# Altium schematic sheet handm_altimeter.SchDoc
size A4
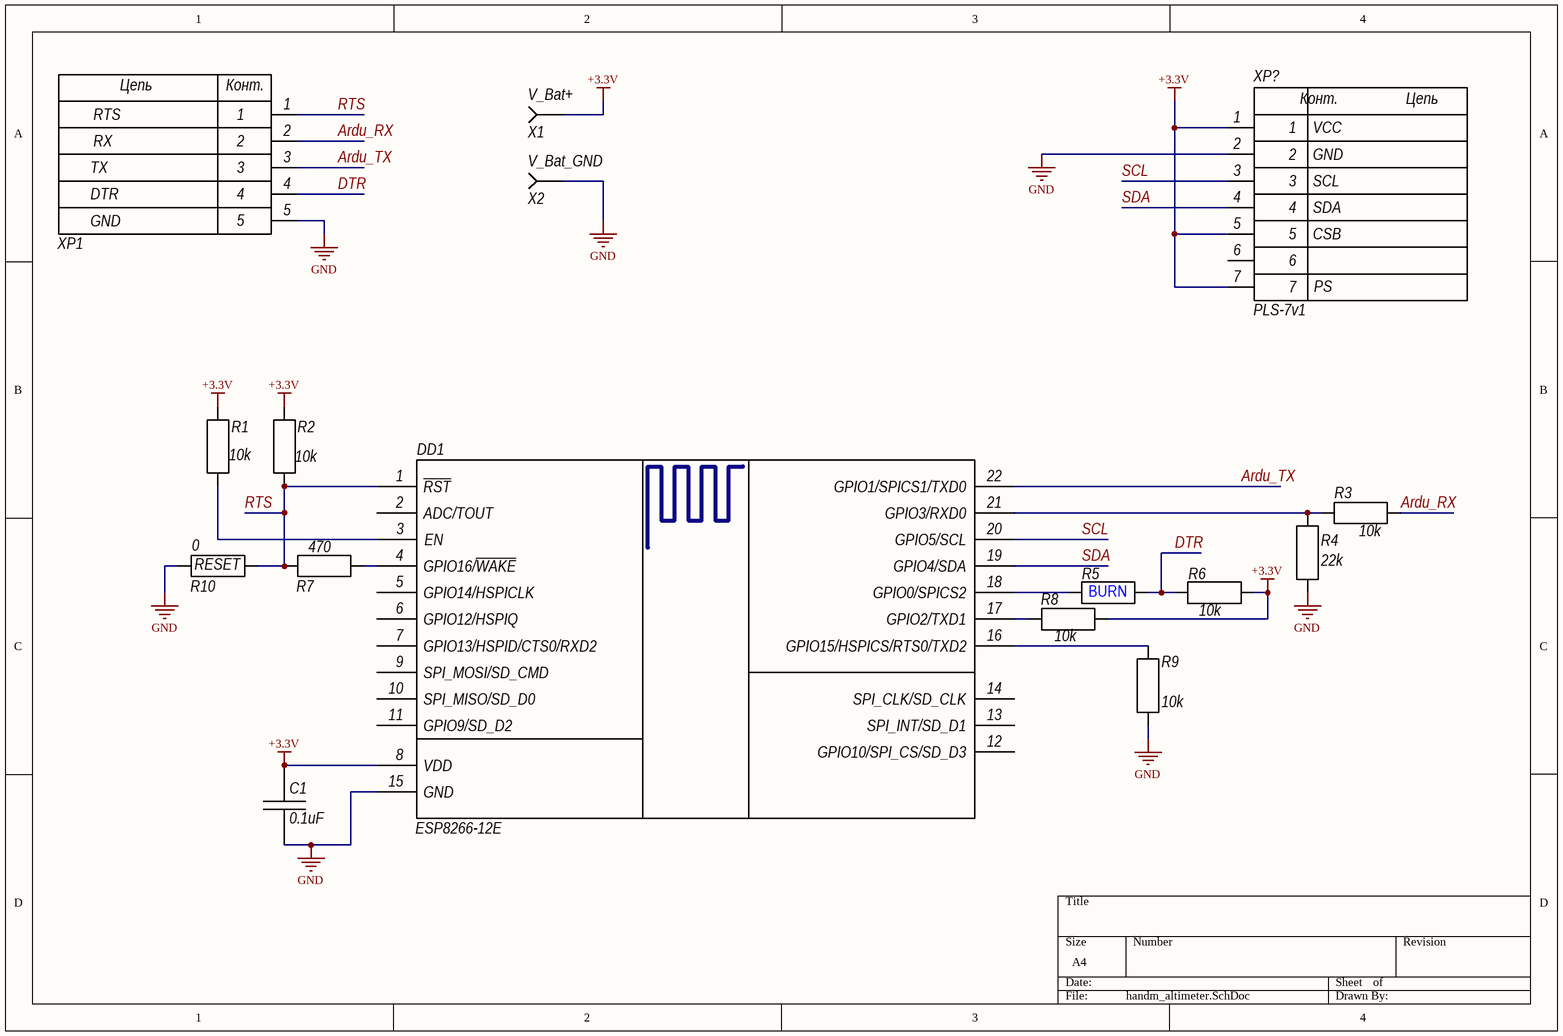
[diagram p0: handm_altimeter.SchDoc]

## Parts
C1  value 0.1uF  [CAP EIA 0603]  (hidden comment: Cap EIA 0603)
DD1  ESP8266-12E  [ESP8266 ESP-12-E]
R1  value 10k  [RES EIA 0603]  (hidden comment: Res EIA 0603)
R2  value 10k  [RES EIA 0603]  (hidden comment: Res EIA 0603)
R3  value 10k  [RES EIA 0603]  (hidden comment: Res EIA 0603)
R4  value 22k  [RES EIA 0603]  (hidden comment: Res EIA 0603)
R5  BURN  [RES EIA 0603]
R6  value 10k  [RES EIA 0603]  (hidden comment: Res EIA 0603)
R7  value 470  [RES EIA 0603]  (hidden comment: Res EIA 0603)
R8  value 10k  [RES EIA 0603]  (hidden comment: Res EIA 0603)
R9  value 10k  [RES EIA 0603]  (hidden comment: Res EIA 0603)
R10  value 0  [RES EIA 0603]  (hidden comment: Res EIA 0603)
X1  V_Bat+  [Pin - Referal]  (no BOM)
X2  V_Bat_GND  [Pin - Referal]  (no BOM)
XP1  BM05B-SRSS-TB  [BM05B-SRSS-TB]  (value not drawn)
XP?  PLS-7v1  [PLS-7v1]

## Nets
+3.3V: C1.2 DD1.8(VDD) R1.2 R2.2 R6.2 R8.2 X1.1 XP?.1 XP?.5 XP?.7
GND: C1.1 DD1.15(GND) R4.1 R9.1 R10.1 X2.1 XP1.5 XP?.2
Ardu_RX: R3.2 XP1.2
Ardu_TX: DD1.22(GPIO1/SPICS1/TXD0) XP1.3
DTR: R5.2 R6.1 XP1.4
RTS: DD1.1(~{RST}) R2.1 R7.1 R10.2 XP1.1
SCL: DD1.20(GPIO5/SCL) XP?.3
SDA: DD1.19(GPIO4/SDA) XP?.4
NetDD1_3: DD1.3(EN) R1.1
NetDD1_4: DD1.4(GPIO16/~{WAKE}) R7.2
NetDD1_16: DD1.16(GPIO15/HSPICS/RTS0/TXD2) R9.2
NetDD1_17: DD1.17(GPIO2/TXD1) R8.1
NetDD1_18: DD1.18(GPIO0/SPICS2) R5.1
NetDD1_21: DD1.21(GPIO3/RXD0) R3.1 R4.2

Not connected (* = marked no-connect by the designer): DD1 2(ADC/TOUT) 5(GPIO14/HSPICLK) 6(GPIO12/HSPIQ) 7(GPIO13/HSPID/CTS0/RXD2) 9(SPI_MOSI/SD_CMD) 10(SPI_MISO/SD_D0) 11(GPIO9/SD_D2) 12(GPIO10/SPI_CS/SD_D3) 13(SPI_INT/SD_D1) 14(SPI_CLK/SD_CLK); XP? 6

## Notes on the sheet
- TX
- RTS
- RX
- GND
- VCC
- DTR
- SCL
- SDA
- CSB
- PS
- (near R10) RESET
- (in symbol BM05B-SRSS-TB) Цепь; Конт.
- (in symbol PLS-7v1) Конт.; Цепь

## Library data of the parts
C1 = Cap EIA 0603: Group: Конденсаторы; Manufacturer: *; Name: *; Supplier: *
DD1 = ESP8266 ESP-12E-RU
R1-R10 = Res EIA 0603: Group: Резисторы; Manufacturer: *; Name: *; Supplier: *
  R5: Value: *
X1 X2 = Pin_Referal: Generic Pin Contact; Value: Generic Pin Contact Referal; Group: -; Manufacturer: -; Name: -; Supplier: -
XP1 = BM05B-SRSS-TB: 5-Pin Angle Connector; Manufacturer: JST; Group: Разъемы; Value: Разъем штыревой 5-и контактный угловой; Name: BM05B-SRSS-TB; Supplier: ООО"Компэл"